# Altium schematic sheet Sheet1.SchDoc
size A4; SheetNumber: 1; SheetTotal: 1
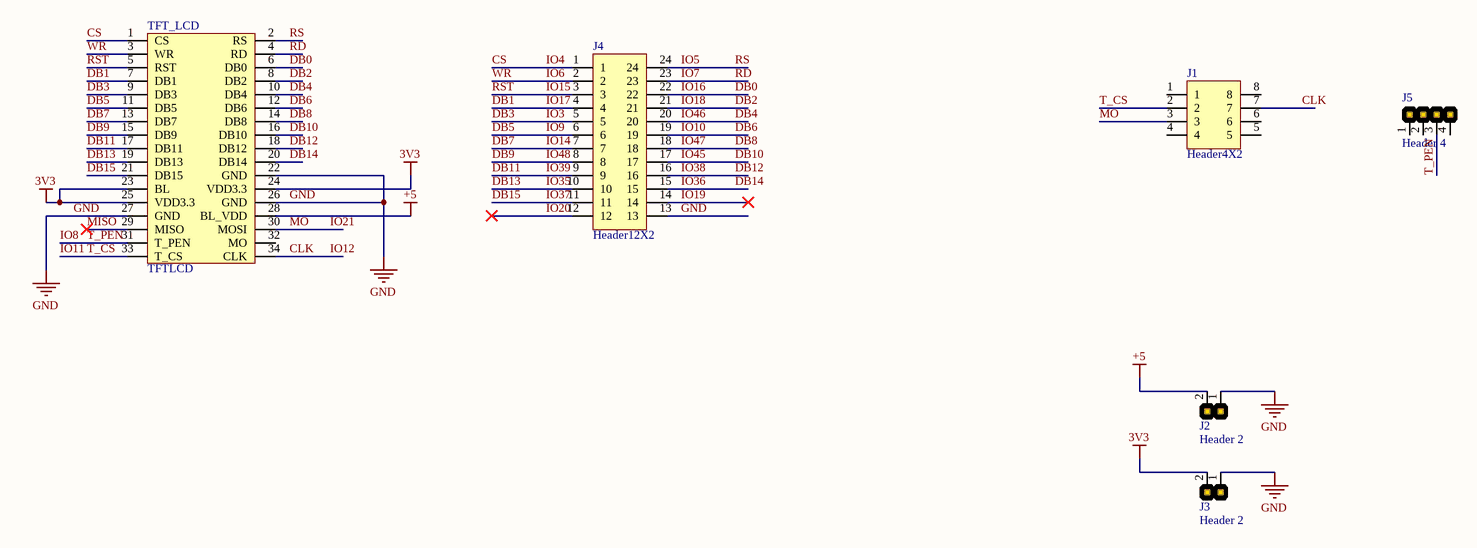
[diagram p0: Sheet1.SchDoc]

## Parts
J1  Header4X2  [HDR4X2]
J2  Header 2  [HDR2]
J3  Header 2  [HDR2]
J4  Header12X2  [HDR12X2_Female]
J5  Header 4  [HDR4]
TFT_LCD  TFTLCD  [TFTLCD-4.3]

## Nets
3V3: J3.2 TFT_LCD.23(BL) TFT_LCD.24(VDD3.3) TFT_LCD.25(VDD3.3)
+5: J2.2 TFT_LCD.28(BL_VDD)
GND: J2.1 J3.1 J4.13 TFT_LCD.22(GND) TFT_LCD.26(GND) TFT_LCD.27(GND)
CLK: J1.7 TFT_LCD.34(CLK)  [also labelled IO12]
CS: J4.1 TFT_LCD.1(CS)  [also labelled IO4]
DB0: J4.22 TFT_LCD.6(DB0)  [also labelled IO16]
DB1: J4.4 TFT_LCD.7(DB1)  [also labelled IO17]
DB2: J4.21 TFT_LCD.8(DB2)  [also labelled IO18]
DB3: J4.5 TFT_LCD.9(DB3)  [also labelled IO3]
DB4: J4.20 TFT_LCD.10(DB4)  [also labelled IO46]
DB5: J4.6 TFT_LCD.11(DB5)  [also labelled IO9]
DB6: J4.19 TFT_LCD.12(DB6)  [also labelled IO10]
DB7: J4.7 TFT_LCD.13(DB7)  [also labelled IO14]
DB8: J4.18 TFT_LCD.14(DB8)  [also labelled IO47]
DB9: J4.8 TFT_LCD.15(DB9)  [also labelled IO48]
DB10: J4.17 TFT_LCD.16(DB10)  [also labelled IO45]
DB11: J4.9 TFT_LCD.17(DB11)  [also labelled IO39]
DB12: J4.16 TFT_LCD.18(DB12)  [also labelled IO38]
DB13: J4.10 TFT_LCD.19(DB13)  [also labelled IO35]
DB14: J4.15 TFT_LCD.20(DB14)  [also labelled IO36]
DB15: J4.11 TFT_LCD.21(DB15)  [also labelled IO37]
IO5: J4.24 TFT_LCD.2(RS)  [also labelled RS]
IO6: J4.2 TFT_LCD.3(WR)  [also labelled WR]
IO7: J4.23 TFT_LCD.4(RD)  [also labelled RD]
IO8: J5.3 TFT_LCD.31(T_PEN)  [also labelled T_PEN]
IO11: J1.2 TFT_LCD.33(T_CS)  [also labelled T_CS]
IO15: J4.3 TFT_LCD.5(RST)  [also labelled RST]
IO19: J4.14
IO20: J4.12
IO21: J1.3 TFT_LCD.30(MOSI)  [also labelled MO]
MISO: TFT_LCD.29(MISO)

Not connected (* = marked no-connect by the designer): J1 1 4 5 6 8; J5 1 2 4; TFT_LCD 32(MO)

## Library data of the parts
TFT_LCD = TFTLCD: 正点原子MCU屏通用接口